# Altium schematic sheet realSchematic.SchDoc
size A4
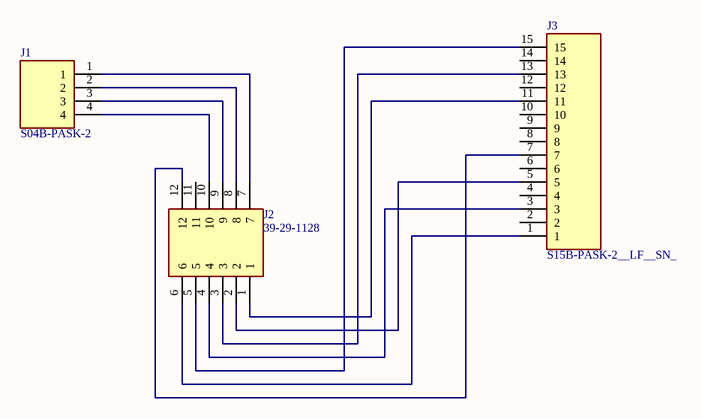
[diagram p0: realSchematic.SchDoc]

## Parts
J1  S04B-PASK-2  [S04BPASK2]
J2  39-29-1128  [39291128]
J3  S15B-PASK-2__LF__SN_  [S15BPASK2LFSN]

## Nets
NetJ1_1: J1.1 J2.7
NetJ1_2: J1.2 J2.8
NetJ1_3: J1.3 J2.9
NetJ1_4: J1.4 J2.10
NetJ2_1: J2.1 J3.11
NetJ2_2: J2.2 J3.5
NetJ2_3: J2.3 J3.13
NetJ2_4: J2.4 J3.3
NetJ2_5: J2.5 J3.15
NetJ2_6: J2.6 J3.1
NetJ2_12: J2.12 J3.7

Not connected (* = marked no-connect by the designer): J2 11; J3 2 4 6 8 9 10 12 14

## Library data of the parts
J1 = S04B-PASK-2: Connector; Manufacturer_Name: JST (JAPAN SOLDERLESS TERMINALS); Datasheet Link: http://www.jst-mfg.com/product/pdf/eng/ePA-F.pdf?5d80b7662b42f; Height: 6.5mm; Manufacturer_Part_Number: S04B-PASK-2
J2 = 39-29-1128: Connector; Manufacturer_Name: Molex; Datasheet Link: https://www.molex.com/pdm_docs/sd/039291128_sd.pdf; Height: 11.7mm; Manufacturer_Part_Number: 39-29-1128; Mouser Part Number: 538-39-29-1128; Mouser Price/Stock: https://www.mouser.co.uk/ProductDetail/Molex/39-29-1128?qs=53in8j6h7oTziUEN8ceqiA%3D%3D
J3 = S15B-PASK-2__LF__SN_: Connector; Manufacturer_Name: JST (JAPAN SOLDERLESS TERMINALS); Manufacturer_Part_Number: S15B-PASK-2 (LF)(SN); Datasheet Link: http://uk.rs-online.com/web/p/products/5469498; Height: 7.7mm